# EAGLE design QI-01 (EAGLE 8.7.1)
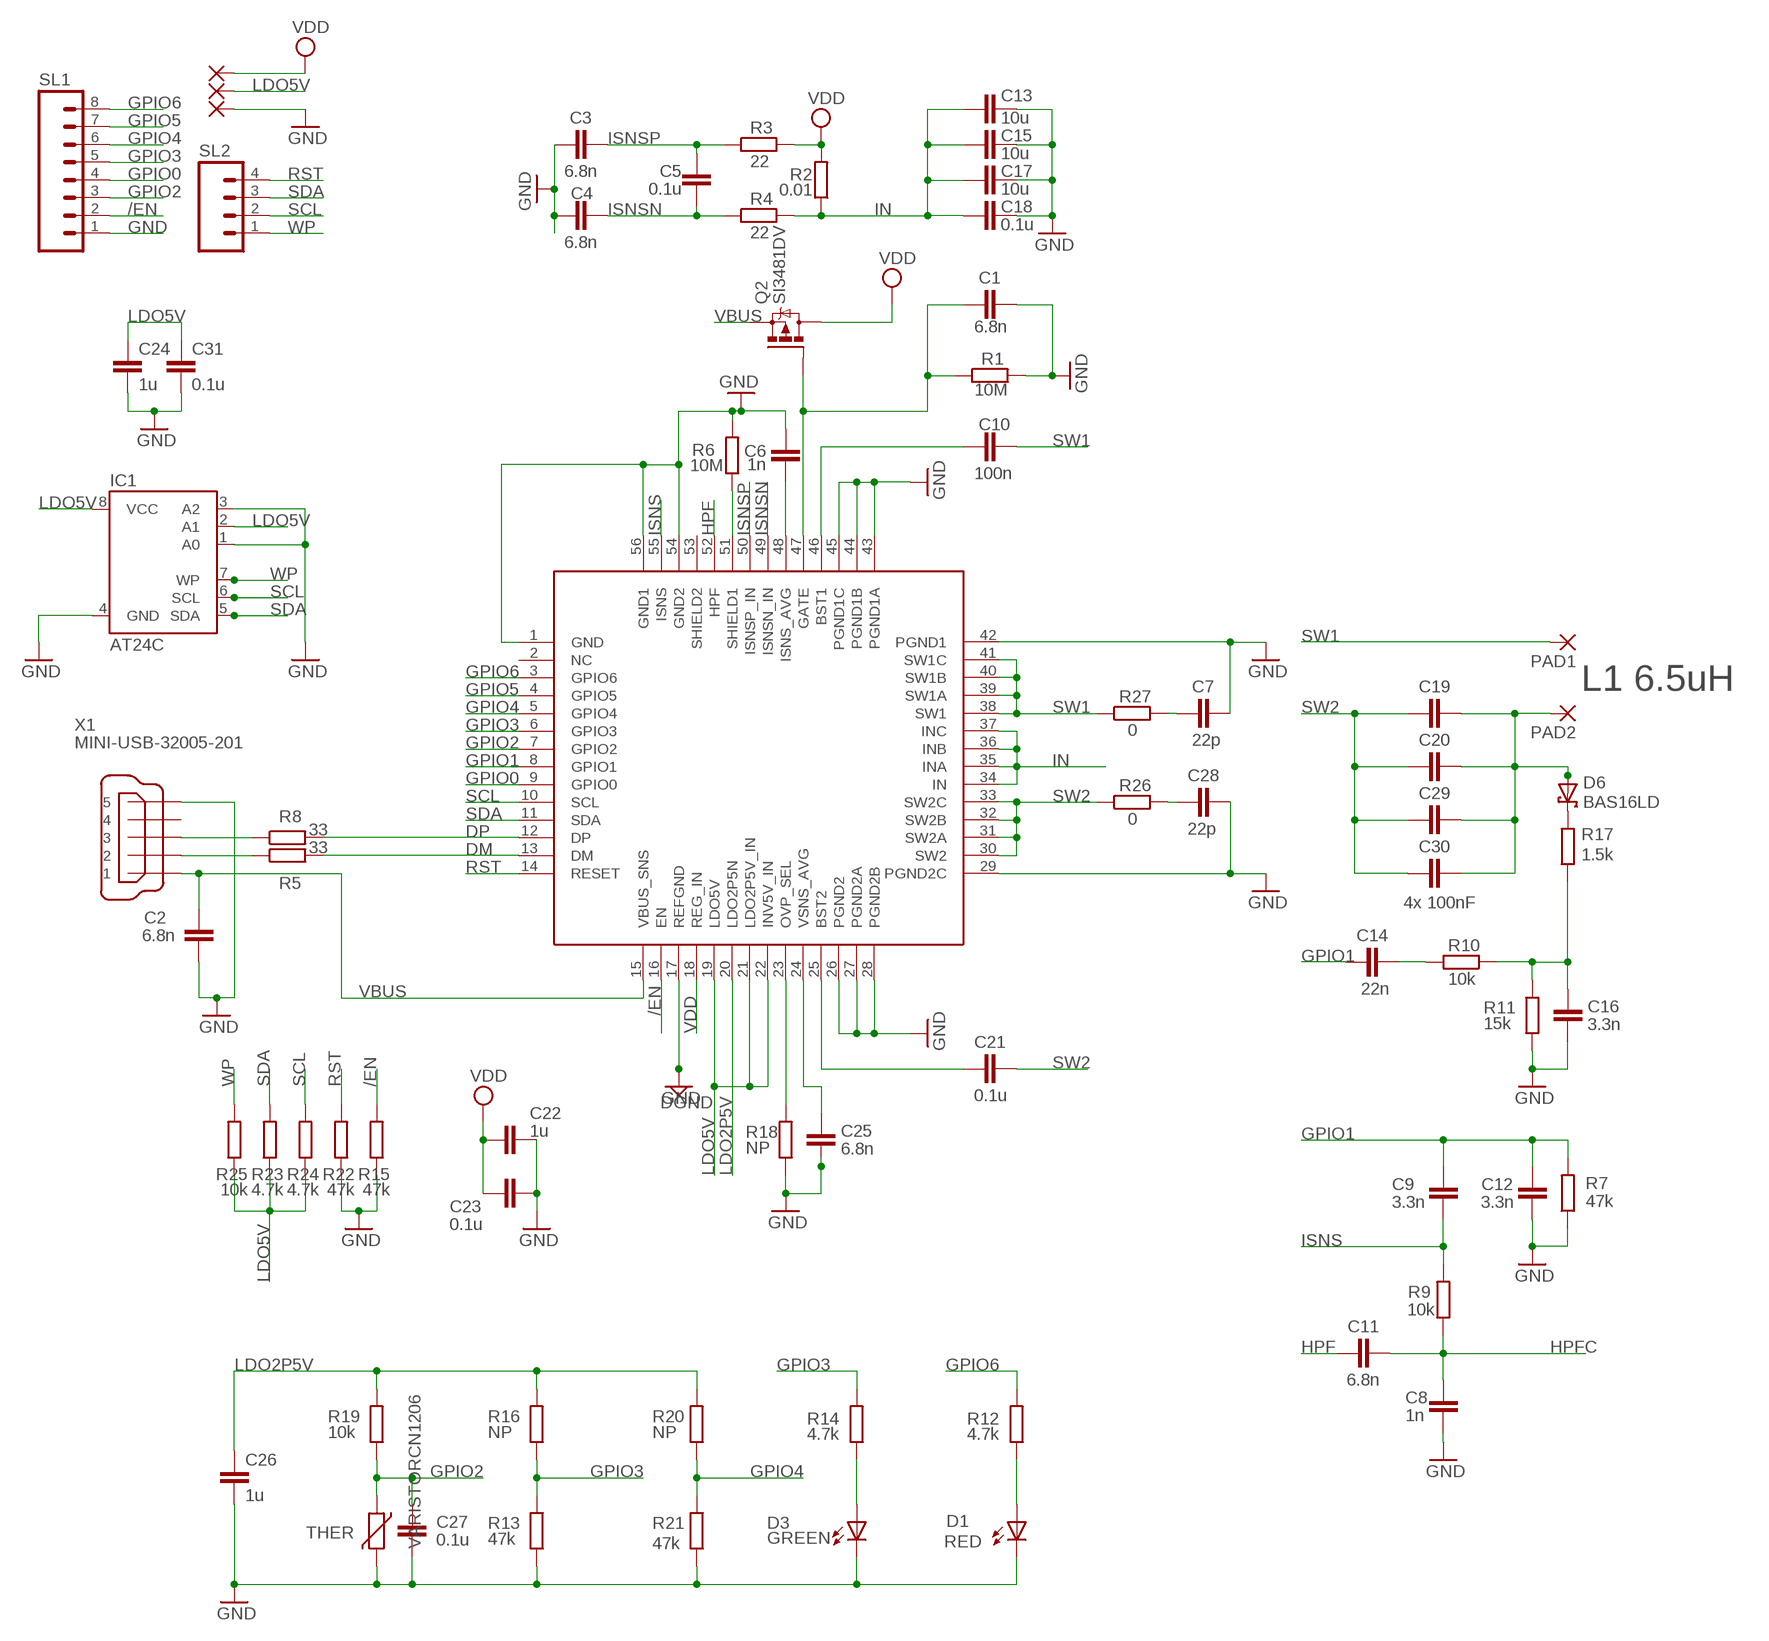
[diagram p0: schematic, sheet 1]

## Parts
C1  6.8n  C-EUC0402  [C0402]
C2  6.8n  C-EUC0402  [C0402]
C3  6.8n  C-EUC0402  [C0402]
C4  6.8n  C-EUC0402  [C0402]
C5  0.1u  C-EUC0402  [C0402]
C6  1n  C-EUC0402  [C0402]
C7  22p  C-EUC0402  [C0402]
C8  1n  C-EUC0402  [C0402]
C9  3.3n  C-EUC0402  [C0402]
C10  100n  C-EUC0402  [C0402]
C11  6.8n  C-EUC0402  [C0402]
C12  3.3n  C-EUC0402  [C0402]
C13  10u  C-EUC0805  [C0805]
C14  22n  C-EUC0402  [C0402]
C15  10u  C-EUC0805  [C0805]
C16  3.3n  C-EUC0402  [C0402]
C17  10u  C-EUC0805  [C0805]
C18  0.1u  C-EUC0402  [C0402]
C19  100n  C-EUC1206  [C1206]
C20  100n  C-EUC1206  [C1206]
C21  0.1u  C-EUC0402  [C0402]
C22  1u  C-EUC0402  [C0402]
C23  0.1u  C-EUC0402  [C0402]
C24  1u  C-EUC0402  [C0402]
C25  6.8n  C-EUC0402  [C0402]
C26  1u  C-EUC0402  [C0402]
C27  0.1u  C-EUC0402  [C0402]
C28  22p  C-EUC0402  [C0402]
C29  100n  C-EUC1206  [C1206]
C30  100n  C-EUC1206  [C1206]
C31  0.1u  C-EUC0402  [C0402]
D1  RED  LEDSML0603  [SML0603]
D3  GREEN  LEDSML0603  [SML0603]
D6  BAS16LD  SCHOTTKY-DIODESMD  [SMB]
IC1  AT24C  [TSSOP8]
PAD1  2,54/1,0  [2,54/1,0]
PAD2  2,54/1,0  [2,54/1,0]
PAD3  2,15/1,0  [2,15/1,0]
PAD4  2,15/1,0  [2,15/1,0]
PAD5  2,15/1,0  [2,15/1,0]
Q2  SI3481DV  [TSOP-6.PAC]
R1  10M  R-EU_R0402  [R0402]
R2  0.01  R-EU_R0805  [R0805]
R3  22  R-EU_R0402  [R0402]
R4  22  R-EU_R0402  [R0402]
R5  33  R-EU_R0402  [R0402]
R6  10M  R-EU_R0402  [R0402]
R7  47k  R-EU_R0402  [R0402]
R8  33  R-EU_R0402  [R0402]
R9  10k  R-EU_R0402  [R0402]
R10  10k  R-EU_R0402  [R0402]
R11  15k  R-EU_R0402  [R0402]
R12  4.7k  R-EU_R0402  [R0402]
R13  47k  R-EU_R0603  [R0603]
R14  4.7k  R-EU_R0402  [R0402]
R15  47k  R-EU_R0603  [R0603]
R16  NP  R-EU_R0402  [R0402]
R17  1.5k  R-EU_R0402  [R0402]
R18  NP  R-EU_R0402  [R0402]
R19  10k  R-EU_R0402  [R0402]
R20  NP  R-EU_R0402  [R0402]
R21  47k  R-EU_R0603  [R0603]
R22  47k  R-EU_R0603  [R0603]
R23  4.7k  R-EU_R0402  [R0402]
R24  4.7k  R-EU_R0402  [R0402]
R25  10k  R-EU_R0402  [R0402]
R26  0  R-EU_R0402  [R0402]
R27  0  R-EU_R0402  [R0402]
SL1  M08  [08P]
SL2  M04  [04P]
THER  VARISTORCN1206  [CT/CN1206]
U$1  VFQFPN  [ZADANIE]
X1  MINI-USB-32005-201  [32005-201]

## Nets
/EN: R15.2 SL1.2 U$1.16(EN)
DM: R5.2 U$1.13(DM)
DP: R8.2 U$1.12(DP)
GND: C1.1 C2.1 C3.1 C4.1 C6.1 C7.1 C8.1 C12.1 C13.1 C15.1 C16.2 C17.1 C18.1 C22.1 C23.1 C24.2 C25.2 C26.2 C27.2 C28.1 C31.2 D1.C D3.C IC1.1(A0) IC1.3(A2) IC1.4(GND) PAD5.1(P) R1.2 R6.2 R7.1 R11.1 R13.1 R15.1 R18.1 R21.1 R22.1 SL1.1 THER.2 U$1.1(GND) U$1.17(REFGND) U$1.26(PGND2) U$1.27(PGND2A) U$1.28(PGND2B) U$1.29(PGND2C) U$1.42(PGND1) U$1.43(PGND1A) U$1.44(PGND1B) U$1.45(PGND1C) U$1.54(GND2) U$1.56(GND1) X1.5 ; supply symbol labelled DGND
GPIO0: SL1.4 U$1.9(GPIO0)
GPIO1: C9.2 C12.2 C14.1 R7.2 U$1.8(GPIO1)
GPIO2: C27.1 R19.1 SL1.3 THER.1 U$1.7(GPIO2)
GPIO3: R13.2 R14.2 R16.1 SL1.5 U$1.6(GPIO3)
GPIO4: R20.1 R21.2 SL1.6 U$1.5(GPIO4)
GPIO5: SL1.7 U$1.4(GPIO5)
GPIO6: R12.2 SL1.8 U$1.3(GPIO6)
HPF: C11.1 U$1.52(HPF)
HPFC: C8.2 C11.2 R9.1
IN: C13.2 C15.2 C17.2 C18.2 R2.1 R4.2 U$1.34(IN) U$1.35(INA) U$1.36(INB) U$1.37(INC)
ISNS: C9.1 R9.2 U$1.55(ISNS)
ISNSN: C4.2 C5.1 R4.1 U$1.49(ISNSN_IN)
ISNSP: C3.2 C5.2 R3.1 U$1.50(ISNSP_IN)
LDO2P5V: C26.1 R16.2 R19.2 R20.2 U$1.20(LDO2P5N)
LDO5V: C24.1 C31.1 IC1.2(A1) IC1.8(VCC) PAD4.1(P) R23.1 R24.1 R25.1 U$1.19(LDO5V) U$1.21(LDO2P5V_IN) U$1.22(INV5V_IN)
N$1: C10.2 U$1.46(BST1)
N$2: R18.2 U$1.23(OVP_SEL)
N$3: C7.2 R27.2
N$5: C16.1 R10.1 R11.2 R17.1
N$6: C21.2 U$1.25(BST2)
N$8: C14.2 R10.2
N$15: C25.1 U$1.24(VSNS_AVG)
N$20: R8.1 X1.3
N$26: R5.1 X1.2
N$29: C19.1 C20.1 C29.1 C30.1 D6.A PAD2.1(P)
N$30: D6.C R17.2
N$31: C28.2 R26.2
N$33: C6.2 U$1.48(ISNS_AVG)
N$35: C1.2 Q2.3(G) R1.1 U$1.47(GATE)
N$37: R6.1 U$1.51(SHIELD1)
N$52: D3.A R14.1
N$54: D1.A R12.1
RST: R22.2 SL2.4 U$1.14(RESET)
SCL: IC1.6(SCL) R24.2 SL2.2 U$1.10(SCL)
SDA: IC1.5(SDA) R23.2 SL2.3 U$1.11(SDA)
SW1: C10.1 PAD1.1(P) R27.1 U$1.38(SW1) U$1.39(SW1A) U$1.40(SW1B) U$1.41(SW1C)
SW2: C19.2 C20.2 C21.1 C29.2 C30.2 R26.1 U$1.30(SW2) U$1.31(SW2A) U$1.32(SW2B) U$1.33(SW2C)
VBUS: C2.2 Q2.4(S) U$1.15(VBUS_SNS) X1.1
VDD: C22.2 C23.2 PAD3.1(P) Q2.1(D) Q2.2(D) Q2.5(D) Q2.6(D) R2.2 R3.2 U$1.18(REG_IN)
WP: IC1.7(WP) R25.2 SL2.1
Unconnected: U$1.2(NC) U$1.53(SHIELD2) X1.4

## Notes on the sheet
- L1 6.5uH
- 4x 100nF

## Library data of the parts
C1-C31 = rcl:C-EU: CAPACITOR, European symbol; SPICEPREFIX: C
D1 D3 = led:LED: LED OSRAM: - CHIPLED LG R971, LG N971, LY N971, LG Q971, LY Q971, LO R971, LY R971 LH N974, LH R974 LS Q976, LO Q976, LY Q976 LO Q996 - Hyper CHIPLED LW Q18S LB Q993, LB Q99A, LB R99A - SideLED LS A670, LO A670, LY A670, LG A670, LP A670 LB A673, LV A673, LT A673, LW A673 LH A674 LY A675 LS A676, LA A676, LO A676, LY A676, LW A676 LS A679, LY A679, LG A679 - Hyper Micro SIDELED® LS Y876, LA Y876, LO Y876, LY Y876 LT Y87S - SmartLED LW L88C, LW L88S LB L89C, LB L89S, LG L890 LS L89K, LO L89K, LY L89K LS L896, LA L896, LO L896, LY L896 - TOPLED LS T670, LO T670, LY T670, LG T670, LP T670 LSG T670, LSP T670, LSY T670, LOP T670, LYG T670 LG T671, LOG T671, LSG T671 LB T673, LV T673, LT T673, LW T673 LH T674 LS T676, LA T676, LO T676, LY T676, LB T676, LH T676, LSB T676, LW T676 LB T67C, LV T67C, LT T67C, LS T67K, LO T67K, LY T67K, LW E67C LS E67B, LA E67B, LO E67B, LY E67B, LB E67C, LV E67C, LT E67C LW T67C LS T679, LY T679, LG T679 LS T770, LO T770, LY T770, LG T770, LP T770 LB T773, LV T773, LT T773, LW T773 LH T774 LS E675, LA E675, LY E675, LS T675 LS T776, LA T776, LO T776, LY T776, LB T776 LHGB T686 LT T68C, LB T68C - Hyper Mini TOPLED® LB M676 - Mini TOPLED Santana® LG M470 LS M47K, LO M47K, LY M47K Source: http://www.osram.convergy.de LUXEON: - LUMILED® LXK2-PW12-R00, LXK2-PW12-S00, LXK2-PW14-U00, LXK2-PW14-V00 LXK2-PM12-R00, LXK2-PM12-S00, LXK2-PM14-U00 LXK2-PE12-Q00, LXK2-PE12-R00, LXK2-PE12-S00, LXK2-PE14-T00, LXK2-PE14-U00 LXK2-PB12-K00, LXK2-PB12-L00, LXK2-PB12-M00, LXK2-PB14-N00, LXK2-PB14-P00, LXK2-PB14-Q00 LXK2-PR12-L00, LXK2-PR12-M00, LXK2-PR14-Q00, LXK2-PR14-R00 LXK2-PD12-Q00, LXK2-PD12-R00, LXK2-PD12-S00 LXK2-PH12-R00, LXK2-PH12-S00 LXK2-PL12-P00, LXK2-PL12-Q00, LXK2-PL12-R00 Source: www.luxeon.com KINGBRIGHT: KA-3528ASYC Source: www.kingbright.com
D6 = diode:SCHOTTKY-DIODE: Schottky Diode
IC1 = atmel:AT24C*: 2-wire serial EEPROM; SPICEPREFIX: X
PAD1 PAD2 = wirepad:2,54/1,0: THROUGH-HOLE PAD
PAD3-PAD5 = wirepad:2,15/1,0: THROUGH-HOLE PAD
Q2 = transistor-power:SI3481DV: P-Channel 30-V (D-S) MOSFET Source: http://www.vishay.com/docs/72105/72105.pdf
R1-R27 = rcl:R-EU_: RESISTOR, European symbol; SPICEPREFIX: R
SL1 = con-amp-quick:M08: AMP QUICK CONNECTOR; OC_FARNELL: unknown; OC_NEWARK: unknown
SL2 = con-amp-quick:M04: AMP QUICK CONNECTOR; OC_FARNELL: unknown; OC_NEWARK: unknown
THER = varistor:VARISTOR: VARISTOR
U$1 = zadanie2 - 01:VFQFPN
X1 = con-cypressindustries:MINI-USB-: MINI USB-B Conector Source: www.cypressindustries.com; OC_FARNELL: unknown; OC_NEWARK: unknown

## Board
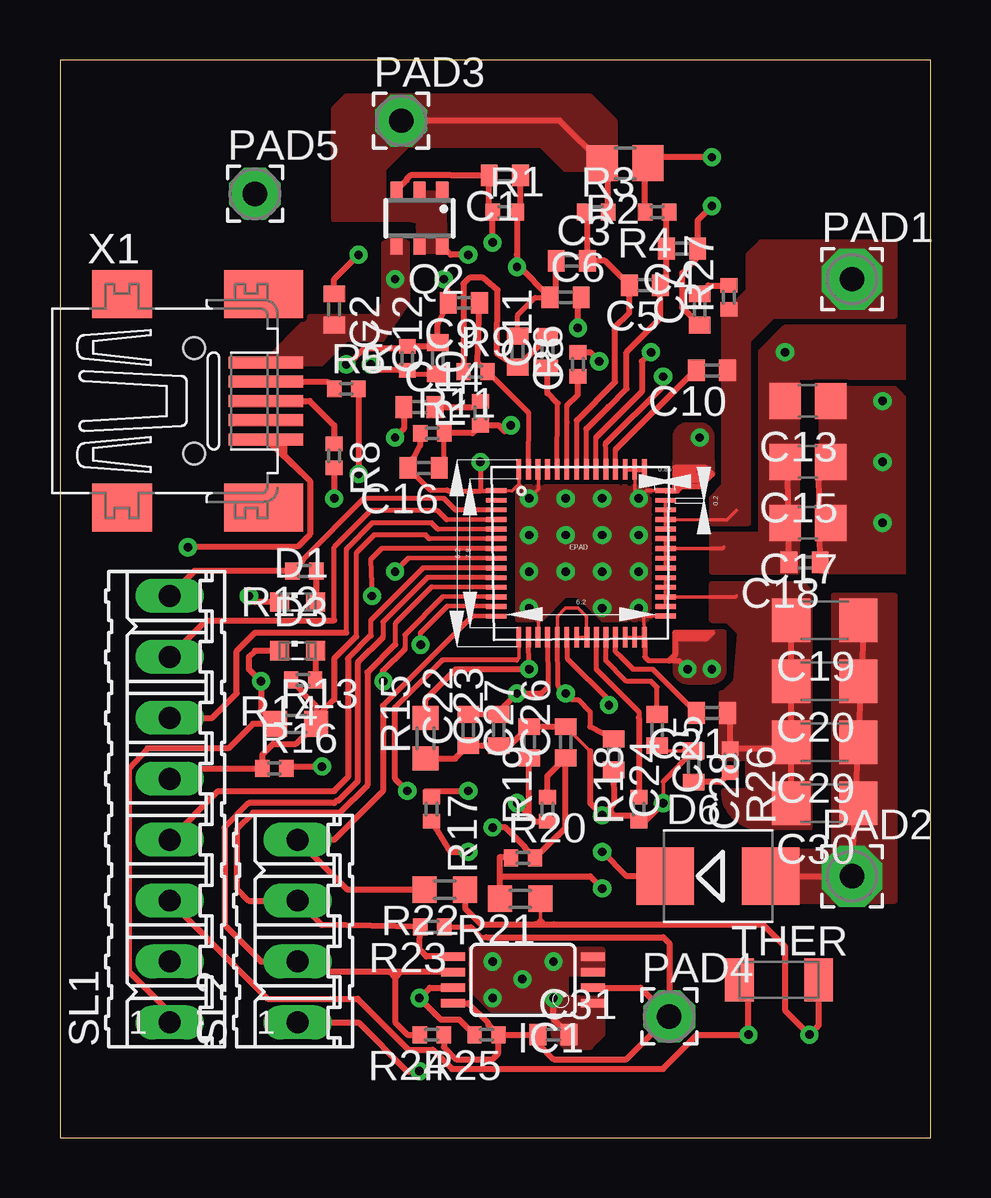
[diagram p1: board, top side]
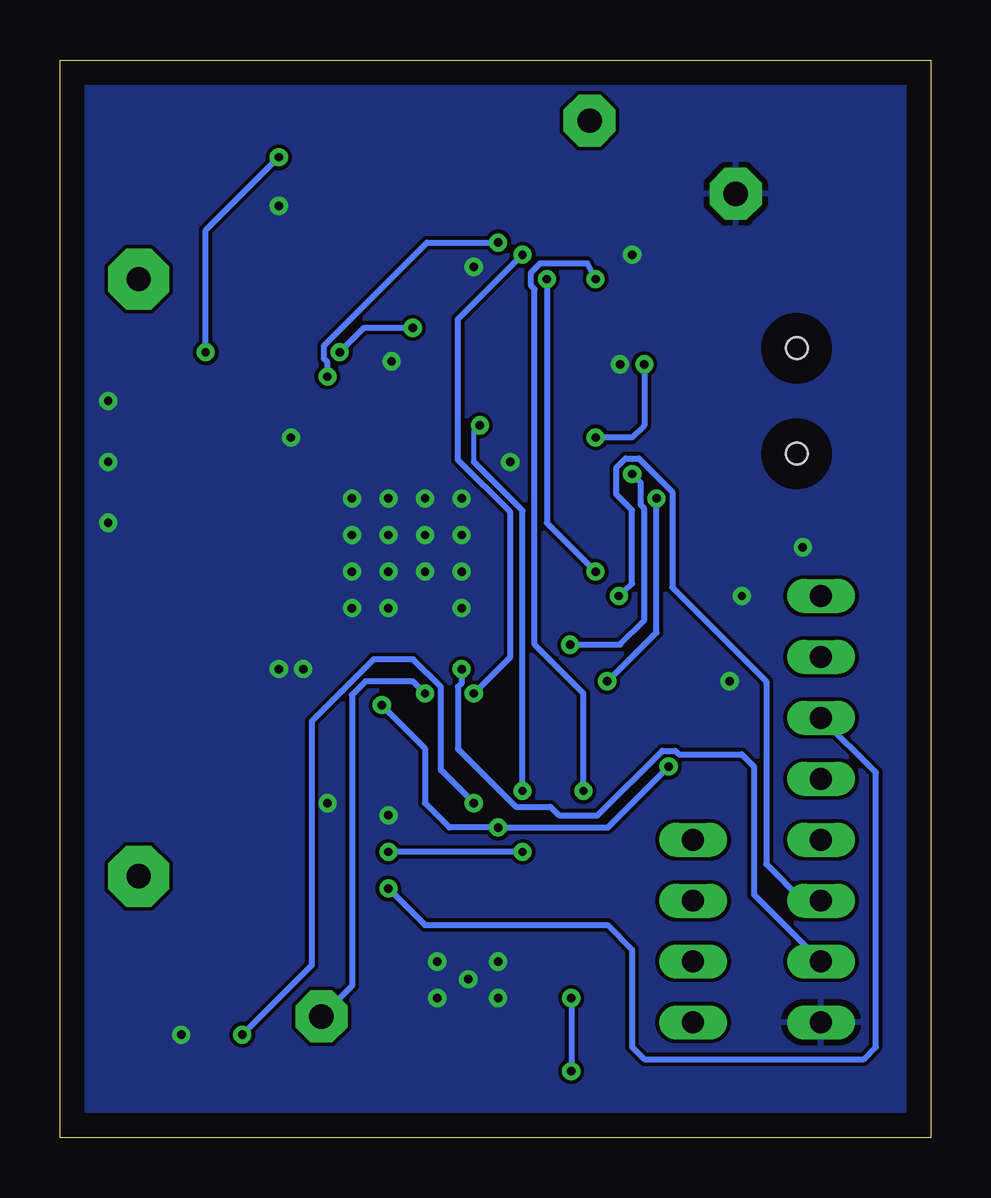
[diagram p2: board, bottom side, seen from below]

Size 36.3 x 44.93 mm. Coordinates in mm from the lower left corner, seen from the top.
Outline: 0,0 36.3,0 36.3,44.93 0,44.93 0,0
Copper layers (1*16): Top 0.035mm / dielectric 1.5mm / Bottom 0.035mm
Design rules "default": minimum track width 6mil, minimum drill 0.35mm, track to track 6mil, track to pad 6mil, pad to pad 6mil, via to via 6mil, smd to smd 6mil, copper to edge 40mil, drill to drill 6mil, minimum pad ring 10mil, minimum via ring 8mil, stop-mask expansion 4mil, vias tented up to drill 0mil, thermal gap 10mil

### Footprints (pad centres in the part's own frame; a part is rotated, then mirrored left to right if it is on the bottom)
C0402 = smd 0.7 x 0.9: 1 -0.65,0; 2 0.65,0
C0805 = smd 1.3 x 1.5: 1 -0.95,0; 2 0.95,0
C1206 = smd 1.6 x 1.8: 1 -1.4,0; 2 1.4,0
SML0603 = smd 0.8 x 0.8: A 0.75,0; C -0.75,0
SMB = smd 2.4 x 2.4: A 2.2,0; C -2.2,0
TSSOP8 = smd 0.35 x 1: 1 -0.975,-2.925; 2 -0.325,-2.925; 3 0.325,-2.925; 4 0.975,-2.925; 5 0.975,2.925; 6 0.325,2.925; 7 -0.325,2.925; 8 -0.975,2.925
2,54/1,0 = drill 1.016 pad 2.54 octagon: 1 0,0
2,15/1,0 = drill 1.016 pad 2.159 octagon: 1 0,0
TSOP-6.PAC = smd 0.508 x 0.7: 1 -0.95,-1.163; 2 0,-1.163; 3 0.95,-1.163; 4 0.95,1.163; 5 0,1.163; 6 -0.95,1.163
R0402 = smd 0.6 x 0.7: 1 -0.5,0; 2 0.5,0
R0805 = smd 1.3 x 1.5: 1 -0.95,0; 2 0.95,0
R0603 = smd 1 x 1.1: 1 -0.85,0; 2 0.85,0
08P = drill 0.914 long: 1 -8.89,0; 2 -6.35,0; 3 -3.81,0; 4 -1.27,0; 5 1.27,0; 6 3.81,0; 7 6.35,0; 8 8.89,0
04P = drill 0.914 long: 1 -3.81,0; 2 -1.27,0; 3 1.27,0; 4 3.81,0
CT/CN1206 = smd 1.2 x 1.8: 1 -1.65,0; 2 1.65,0
ZADANIE = smd 0.85 x 0.2: 1 -41.75,9.215; 2 -41.75,8.815; 3 -41.75,8.415; 4 -41.75,8.015; 5 -41.75,7.615; 6 -41.75,7.215; 7 -41.75,6.805; 8 -41.75,6.395; 9 -41.75,5.985; 10 -41.75,5.585; 11 -41.75,5.185; 12 -41.75,4.785; 13 -41.75,4.385; 14 -41.75,3.98; 29 -34.7,3.985; 30 -34.7,4.385; 31 -34.7,4.78; 32 -34.7,5.185; 33 -34.7,5.585; 34 -34.7,5.985; 35 -34.7,6.395; 36 -34.7,6.805; 37 -34.7,7.215; 38 -34.7,7.615; 39 -34.7,8.015; 40 -34.7,8.415; 41 -34.7,8.81; 42 -34.7,9.215 | smd 0.2 x 0.85: 15 -40.815,3.1; 16 -40.415,3.1; 17 -40.015,3.1; 18 -39.615,3.1; 19 -39.215,3.1; 20 -38.815,3.1; 21 -38.405,3.1; 22 -37.98,3.1; 23 -37.585,3.1; 24 -37.185,3.1; 25 -36.785,3.1; 26 -36.385,3.1; 27 -35.985,3.1; 28 -35.585,3.1; 43 -35.585,10.1; 44 -35.985,10.1; 45 -36.385,10.1; 46 -36.785,10.1; 47 -37.185,10.1; 48 -37.595,10.1; 49 -38,10.1; 50 -38.4,10.1; 51 -38.815,10.1; 52 -39.215,10.1; 53 -39.615,10.1; 54 -40.015,10.1; 55 -40.415,10.1; 56 -40.815,10.1
32005-201 = smd 3.1 x 0.5: 1 3,1.6; 2 3,0.8; 3 3,0; 4 3,-0.8; 5 3,-1.6 | smd 2.5 x 2: M1 -3,-4.45; M2 -3,4.45 | smd 3.3 x 2: M3 2.9,4.45; M4 2.9,-4.45 | hole 0.9: 0,2.2; 0,-2.2

### Placement (x,y rotation side)
C1  18.54,40.12 180 top
C2  11.43,34.53 270 top
C3  21.34,36.56 0 top
C4  25.93,37.07 180 top
C5  24.38,35.54 180 top
C6  21.08,35.04 0 top
C7  26.67,34.53 90 top
C8  19.08,32.78 270 top
C9  16.84,34.81 180 top
C10  27.18,31.99 180 top
C11  20.32,32.75 90 top
C12  15.75,32.5 90 top
C13  31.18,30.72 180 top
C14  14.99,30.46 0 top
C15  31.18,28.18 180 top
C16  15.16,27.92 180 top
C17  31.18,25.64 180 top
C18  31.04,23.99 180 top
C19  31.88,21.57 180 top
C20  31.88,19.03 180 top
C21  27.18,17.71 180 top
C22  17.02,17 90 top
C23  18.29,17 90 top
C24  23.09,15.99 270 top
C25  24.89,17 270 top
C26  21.08,16.49 90 top
C27  19.56,16.49 90 top
C28  26.42,15.48 270 top
C29  31.88,16.49 180 top
C30  31.88,13.95 180 top
C31  20.57,4.3 0 top
D1  9.91,22.34 0 top
D3  9.91,20.3 0 top
D6  27.43,10.91 0 top
IC1  19.3,6.59 90 top
PAD1  33.02,35.8 0 top
PAD2  33.02,10.91 0 top
PAD3  14.22,42.4 0 top
PAD4  25.4,5.06 0 top
PAD5  8.13,39.35 0 top
Q2  14.99,38.34 180 top
R1  18.54,38.59 0 top
R2  23.56,40.62 180 top
R3  22.35,38.59 0 top
R4  24.89,38.59 180 top
R5  11.94,31.23 0 top
R6  21.59,32.24 90 top
R7  14.48,32.5 90 top
R8  11.43,28.43 270 top
R9  17.32,31.94 0 top
R10  17.53,30.21 90 top
R11  15.52,29.37 0 top
R12  10.19,23.63 180 top
R13  9.82,17.26 0 top
R14  10.13,19.08 180 top
R15  15.24,16.66 90 top
R16  8.94,15.4 0 top
R17  15.49,13.7 270 top
R18  24.13,13.7 90 top
R19  20.32,13.7 90 top
R20  19.3,11.67 0 top
R21  19.19,9.97 180 top
R22  16.04,10.35 180 top
R23  15.52,8.8 180 top
R24  15.49,4.3 180 top
R25  17.78,4.3 180 top
R26  27.94,15.73 270 top
R27  27.89,35.04 90 top
SL1  4.57,13.7 90 top
SL2  9.91,8.62 90 top
THER  29.97,6.59 0 top
U$1  59.94,17.76 0 top
X1  5.59,30.72 0 top

### Tracks (layer width: path | path; a pad name or v marks a point on that pad's centre or on a via)
/EN  (via drill 0.35)
  Top 0.152: v19.56,19.54 19.54,19.56
  Top 0.2: 19.54,19.56 U$1.16
  Top 0.254: R15.2 15.24,18.27 16.51,19.54 v19.56,19.54
  Bottom 0.254: v19.56,19.54 19.56,18.95 19.71,18.8 19.71,16.22 17.29,13.8 15.85,13.8 15.49,13.45 13.88,13.45 11.19,16.14 10.65,16.14 10.5,15.99 7.87,15.99 7.37,15.48 7.37,10.14 SL1.2
DM  (via drill 0.35)
  Top 0.2: 15.02,20.59 15.02,21.03 16.15,22.16 U$1.13
  Top 0.254: 15.02,20.59 v15.04,20.56 | R5.2 v12.44,27.68 v12.45,27.67
  Bottom 0.254: v15.04,20.56 12.95,20.56 11.94,21.57 11.94,26.23 12.09,26.38 12.09,27.31 v12.45,27.67
DP  (via drill 0.35)
  Top 0.2: 14.38,20.39 14.38,20.96 15.98,22.56 U$1.12
  Top 0.254: v13.49,19.03 13.46,19.47 14.38,20.39 | R8.2 v11.43,26.65
  Bottom 0.254: v13.49,19.03 11.43,21.07 v11.43,26.65
GND  (via drill 0.35)
  Top 0.152: U$1.17 19.94,21.7 v19.56,22.08 | U$1.29 24.45,21.76 v24.13,22.08 24.34,21.87 U$1.28 U$1.27 U$1.26 | 19.14,27.26 U$1.56 | U$1.1 18.85,26.96 19.14,27.26 | 19.14,27.26 19.56,26.84 v19.56,26.65 19.94,27.04 U$1.54 | 22.1,16.13 C26.2 | C25.2 25.12,16.13 C28.1 | U$1.44 23.96,26.82 v24.13,26.65 24.45,26.98 U$1.42 | 25.15,14.86 v25.15,13.95 | R21.1 20.04,9.13 | 20.04,9.13 20.04,8.93 20.07,8.91 | 20.04,9.13 20.26,8.91 20.57,8.91 | 20.04,9.13 19.82,8.91 19.81,8.91
  Top 0.2: U$1.45 U$1.44 U$1.43 | U$1.28 24.38,20.82 24.38,20.05 24.54,19.89 25.4,19.89 25.81,19.89 v26.16,19.54 | C28.1 25.15,14.86 | C8.1 19.08,34.3 19.81,35.04 C6.1 | R7.1 14.63,31.85 C12.1 | 8.38,17.84 R13.1 | C16.2 15.43,27.01 16.15,27.01 16.19,26.96 17.53,26.96 | 17.53,26.96 U$1.1 | v17.53,28.18 17.53,26.96
  Top 0.203: 22.99,13.57 22.86,13.7 | 23.11,13.45 22.99,13.57 | 22.99,13.57 22.99,13.83
  Top 0.254: C18.1 31.64,27.69 C15.1 | v25.15,13.95 24.39,13.2 R18.1 23.88,13.45 23.11,13.45 v22.61,13.45 | 10.25,27.55 10.42,27.38 10.42,25.15 10.25,24.99 9.92,24.66 9.4,24.62 v5.33,24.62 | 10.25,27.55 9.22,28.52 | C2.1 11.43,35.8 v12.45,36.81 | C1.1 19.19,38.74 R1.2 19.04,36.82 19.05,36.81 19.05,36.42 19.11,36.36 | C3.1 20.69,35.29 C6.1 19.11,36.36 | R15.1 16.48,15.81 C22.1 C23.1 18.77,16.35 C27.2 C26.2 | R22.1 16.89,9.58 17.56,8.91 19.81,8.91 20.07,8.91 20.57,8.91 29.3,8.91 30.23,7.98 30.23,5.32 v31.24,4.3 31.62,4.68 THER.2 | C31.2 20.57,4.95 v20.57,5.83 | R6.2 21.6,32.75 22.1,32.75 v22.48,32.37 | v19.05,36.31 19.11,36.36 | v22.61,13.45 22.86,13.7 22.99,13.83 23.11,13.95 C24.2 | v22.61,13.45 22.1,13.95 22.1,16.13 | SL1.1 4.57,5.24 2.87,6.94 2.87,15.38 3.65,16.24 7.03,16.24 8.04,17.26 R13.1 | D1.C 8.13,22.34 v7.87,22.59 | D3.C 8.13,20.3 7.87,20.05 7.87,19.54 v8.38,19.03 8.38,17.84 | R7.1 13.2,32 v12.95,32.24 | R11.1 15.02,28.87 C16.2 | C7.1 25.94,34.61 25.94,36.05 26.5,36.61 26.5,36.98 C4.1 26.58,38.25 v27.18,38.85 | U$1.42 25.73,26.98 25.91,27.16 26.67,27.16 27.18,27.67 26.92,27.92 26.67,27.92 | 26.67,27.92 26.42,27.92 | 26.42,27.92 25.65,27.92 25.65,27.67 | 25.65,27.67 25.65,27.16 25.91,27.42 | 26.16,27.42 25.91,27.42 | 26.67,27.42 26.16,27.42 | 26.67,27.42 26.92,27.67 26.67,27.92 | 26.67,27.42 26.67,27.92 | 26.42,27.67 26.67,27.42 | 26.42,27.67 26.42,27.92 | 26.16,27.42 26.42,27.67 | 25.91,27.67 26.16,27.42 | 25.91,27.67 25.65,27.67 | 25.91,27.42 25.91,27.67 | 25.91,27.42 26.16,27.67 | 26.42,27.92 26.16,27.67 | 26.16,27.67 25.91,27.67 | 25.4,19.89 25.65,20.15 25.65,20.81 | 25.65,20.81 25.65,21.07 27.18,21.07 26.92,20.81 25.65,20.81
  Top 0.254: 8.98,28.77 8.63,29.12 X1.5 8.81,28.9 9.36,28.9 | 8.98,28.77 9.36,28.39 9.36,28.9 | 9.4,28.94 9.36,28.9 | 10.25,27.55 9.03,28.77 8.98,28.77
  other vias: 21.08,26.65 22.61,26.65 24.13,25.13 22.61,25.13 21.08,25.13 19.56,25.13 19.56,23.61 21.08,23.61 22.61,23.61 24.13,23.61 22.61,22.08 26.67,29.19 27.18,19.54 18.03,7.35 20.57,7.35 19.28,6.61 18.03,5.83 34.29,25.64 34.29,28.18 34.29,30.72
  pour Top (no thermals): 25.65,20.56 25.65,19.54 arc90 26.16,19.03 26.67,19.03 27.18,19.03 arc90 27.69,19.54 27.69,20.56 27.69,21.07 27.18,21.07 arc-90 26.67,20.56
  pour Top (no thermals): 31.75,23.61 31.75,31.23 34.8,31.23 35.31,30.72 35.31,23.61
  pour Top (no thermals): 25.65,28.18 26.67,28.18 arc90 27.18,27.67 27.18,29.19 arc90 26.67,29.7 26.16,29.7 arc90 25.65,29.19
  pour Top (no thermals): 25.65,27.16 25.65,28.18 27.18,28.18 27.18,27.67 26.67,27.16
  pour Top (no thermals): 25.65,20.56 25.65,21.07 27.58,21.02 27.69,20.56
  pour Bottom: 0.25,44.43 35.81,44.43 35.81,0.25 0.25,0.25
  pour Top (no thermals): 17.02,7.86 21.08,7.86 22.61,7.86 22.61,6.84 21.59,6.84 21.08,6.84 21.08,5.83 22.61,5.83 22.61,5.32 18.54,5.32 18.03,5.32 17.53,5.83 17.02,6.33
  pour Top (no thermals): 21.08,3.79 22.1,3.79 22.61,4.3 22.61,5.83 20.57,5.83 20.57,4.81 20.57,4.3
  pour Top: 19.05,27.16 19.05,21.57 20.07,21.57 21.08,22.59 21.59,22.59 22.61,21.57 24.64,21.57 24.64,27.16
GPIO0
  Top 0.2: 12.95,20.93 12.95,21.57 15.14,23.76 U$1.9
  Top 0.254: 12.95,20.93 12.01,19.98 12.01,15.04 11.43,14.46 6.6,14.46 SL1.4
GPIO1  (via drill 0.35)
  Top 0.2: v13.97,23.61 14.43,24.06 14.53,24.16 U$1.8
  Top 0.254: v16,35.8 16.11,35.69 C9.2 15.75,33.91 C12.2 15.6,33 R7.2 14.38,32.9 12.68,32.9 12.02,32.24 v11.94,32.24 | C14.1 14.34,29.56 v13.97,29.19
  Bottom 0.254: v16,35.8 16,25.64 v13.97,23.61 | v11.94,32.24 11.94,29.7 12.45,29.19 v13.97,29.19
GPIO2  (via drill 0.35)
  Top 0.2: U$1.7 13.4,24.56 12.95,24.11 v13.01,22.59
  Top 0.254: R19.1 19.8,13.2 19.56,13.45 | 19.56,13.45 C27.1 | 19.56,13.45 v19.05,13.95 | THER.1 28.7,6.21 v28.7,4.3 26.56,4.3 25.14,2.88 16.34,2.88 15.55,3.67 14.54,3.67 12.41,5.8 8.66,5.8 SL1.3
  Bottom 0.254: v13.01,22.59 12.45,23.1 12.45,26.17 13.1,26.82 13.1,27.94 12.72,28.33 12.17,28.33 10.77,26.93 10.77,22.95 6.86,19.03 6.86,11.41 5.33,9.89 SL1.3 | v19.05,13.95 20.42,15.33 20.42,18.8 21.57,19.95 23.23,19.95 25.8,17.37 25.8,7.2 v28.7,4.3
GPIO3
  Top 0.2: 12.34,20.9 12.34,24.39 13.09,25.13 15.24,25.13 15.41,24.96 U$1.6
  Top 0.254: R14.2 10.05,18.66 10.05,18.62 10.67,18.01 10.67,17.51 | 10.67,17.51 R13.2 9.84,16.43 8.89,16.43 8.44,15.98 R16.1 5,15.4 SL1.5 | 12.34,20.9 11.43,19.98 11.43,18.27 10.67,17.51
GPIO4  (via drill 0.35)
  Top 0.2: 11.94,21.07 11.94,24.55 13.02,25.64 15.49,25.64 15.77,25.36 U$1.5
  Top 0.254: SL1.6 6.35,17.51 7.37,18.53 7.37,20.3 8.13,21.07 11.94,21.07 | R21.2 18.34,10.91 | 18.34,10.91 18.34,11.71 18.52,11.69 18.78,11.69 R20.1 | 18.34,10.91 22.1,10.91 v22.61,10.4
  Bottom 0.254: v22.61,10.4 21.08,8.87 13.46,8.87 12.45,7.86 12.45,3.79 11.94,3.29 2.79,3.29 2.29,3.79 2.29,15.22 SL1.6
GPIO5
  Top 0.2: 11.43,21.57 11.43,24.62 12.95,26.15 15.75,26.15 16.13,25.76 U$1.4
  Top 0.254: SL1.7 6.1,21.57 11.43,21.57
GPIO6
  Top 0.2: 10.11,24.1 12.66,26.65 16,26.65 16.49,26.16 U$1.3
  Top 0.254: 10.11,24.1 10.11,24.05 R12.2 5.61,23.63 SL1.8
HPF
  Top 0.2: 20.32,31.73 C11.1 | U$1.52 20.74,30.61
  Top 0.254: 20.74,30.61 20.32,31.04 20.32,31.73
HPFC
  Top 0.254: C11.2 20.32,33.37 C8.2 18.22,32.67 18.25,35.35 17.64,35.85 17.07,35.85 16.82,35.6 R9.1
IN  (via drill 0.35)
  Top 0.152: U$1.34 U$1.35 U$1.36 | U$1.36 U$1.37 | U$1.36 27.63,24.56 27.69,24.62
  Top 0.254: C18.2 30.34,28.07 C15.2 | R4.2 24.39,40.51 R2.1 24.76,40.88 v27.18,40.88
  Bottom 0.254: v30.23,32.75 30.23,37.83 v27.18,40.88
  pour Top (no thermals): 27.18,23.61 30.73,23.61 30.73,31.73 35.31,31.73 35.31,33.77 30.23,33.77 29.21,32.75 29.21,25.13 27.18,25.13
ISNS
  Top 0.2: U$1.55 19.54,30.22 R9.2
  Top 0.254: R9.2 17.41,32.35 C9.1
ISNSN
  Top 0.2: U$1.49 21.94,29.55
  Top 0.254: R4.1 25.29,38.49 C4.2 25.29,35.8 C5.1 25.03,34.16 23.62,32.75 23.62,31.23 22.86,30.46 22.61,30.21 21.94,29.55
ISNSP
  Top 0.2: U$1.50 21.54,29.91
  Top 0.254: R3.1 21.99,38.46 C3.2 22.72,36.56 C5.2 23.73,34.39 23.14,33.8 23.14,31.51 21.54,29.91
LDO2P5V  (via drill 0.35)
  Top 0.152: 22.88,18.25 v22.88,18.04
  Top 0.2: U$1.20 21.14,19.99 22.88,18.25
  Top 0.254: R19.2 20.32,15.08 C26.1 21.08,12.92 20.79,12.62 20.76,12.62 R20.2 19.38,12.09 19.38,12.13 18.58,12.94 v18.03,12.94 | R16.2 9.52,15.48 v10.92,15.48
  Bottom 0.254: v10.92,15.48 13.46,12.94 v18.03,12.94 20.07,12.94 21.08,13.95 21.08,16.24 v22.88,18.04
LDO5V  (via drill 0.35)
  Top 0.152: U$1.19 20.74,21.74 21.08,22.08 21.59,22.08 21.94,21.73 U$1.22 U$1.21
  Top 0.2: U$1.19 20.74,18.86 v21.08,18.53 21.34,18.27 21.59,18.27 22.1,17.76 22.1,17.14
  Top 0.203: R23.1 17.13,8.8 17.56,8.37 17.78,8.37
  Top 0.254: R24.1 16,3.79 16.51,3.29 18.03,3.29 18.28,3.53 R25.1 | R25.1 C31.1 19.92,3.94 20.57,3.29 23.62,3.29 PAD4.1 | R25.1 17.86,4.72 17.86,4.77 17.01,5.61 IC1.8 | IC1.2 24.2,6.26 PAD4.1 | 17.78,8.37 25.15,8.37 25.4,8.11 PAD4.1 | 22.1,17.14 C24.1
  Bottom 0.254: PAD4.1 24.13,6.33 24.13,18.46 23.56,19.03 21.59,19.03 v21.08,18.53
N$1
  Top 0.203: U$1.46 23.16,28.69
  Top 0.254: 23.16,28.69 26.46,31.99 C10.2
N$2
  Top 0.2: U$1.23 22.35,19.54 24.13,17.76 24.13,17.51
  Top 0.254: 24.13,17.51 R18.2
N$3
  Top 0.254: C7.2 27.03,35.54 R27.2
N$5  (via drill 0.35)
  Top 0.2: C16.1 16.02,28.13 R11.2
  Top 0.254: R11.2 17.19,29.37 R10.1 18.28,29.71 18.54,29.45 v18.8,29.7 | R17.1 15.25,14.46 v17.02,14.46
  Bottom 0.2: 19.05,28.18 19.05,29.45 v18.8,29.7
  Bottom 0.254: v17.02,14.46 17.02,26.15 19.05,28.18
N$6
  Top 0.2: 23.4,20.02 23.88,19.54 24.7,19.54 C21.2
  Top 0.203: 23.4,20.02 23.16,20.26 U$1.25
N$8
  Top 0.254: C14.2 17.28,30.46 R10.2
N$15
  Top 0.2: U$1.24 22.74,19.91 23.62,19.03 24.64,19.03 24.89,18.78 C25.1
N$20
  Top 0.254: X1.3 10.41,30.72 11.43,29.7 R8.1
N$26
  Top 0.254: X1.2 11.15,31.52 R5.1
N$29
  Top 0.254: C19.1 33.53,21.33 PAD2.1 D6.A
  pour Top (no thermals): 28.7,9.89 34.8,9.89 34.8,22.59 32.26,22.59 32.26,12.43 32.26,11.92 28.7,11.92
N$30  (via drill 0.35)
  Top 0.254: R17.2 16.26,11.92 v17.02,11.92 | D6.C 23.62,10.91 v22.61,11.92
  Bottom 0.254: v17.02,11.92 v22.61,11.92
N$31
  Top 0.254: C28.2 27.54,14.83 R26.2
N$33  (via drill 0.35)
  Top 0.2: U$1.48 22.34,29.19
  Top 0.254: v21.59,33.77 21.59,34.89 C6.2 | 22.34,29.19 24.26,31.11 24.26,32.37 v24.64,32.75
  Bottom 0.254: v24.64,32.75 23.62,33.77 v21.59,33.77
N$35  (via drill 0.35)
  Top 0.2: U$1.47 22.75,28.68 22.75,28.94
  Top 0.254: Q2.3 14.45,39.92 14.45,39.97 14.62,40.13 16.31,40.13 16.32,40.12 C1.2 17.89,38.74 R1.1 18.03,38.58 v18.03,37.32 | 22.75,28.94 25.15,31.34 v25.15,31.73
  Bottom 0.254: v25.15,31.73 25.15,32.33 25.3,32.48 25.3,33.02 21,37.32 v18.03,37.32
N$37
  Top 0.2: U$1.51 21.14,29.83 21.14,30.53
  Top 0.254: 21.14,30.53 21.59,30.97 R6.1
N$52
  Top 0.254: D3.A 10.66,19.11 R14.1
N$54
  Top 0.254: R12.1 10.69,22.36 D1.A
RST
  Top 0.2: U$1.14 17.21,21.76 13.46,18.02
  Top 0.254: 13.46,18.02 13.46,14.46 11.43,12.43 SL2.4 11.99,10.35 R22.2
SCL
  Top 0.2: 13.46,20.87 13.46,21.51 15.32,23.36 U$1.10
  Top 0.203: 13.72,6.91 13.97,6.66 14.22,6.91
  Top 0.254: 13.46,20.87 12.41,19.82 12.41,14.87 11.6,14.06 11.53,14.06 11.43,13.95 7.87,13.95 6.86,12.94 6.86,8.87 8.38,7.35 SL2.2 10.34,6.91 13.72,6.91 13.97,6.91 | IC1.6 14.22,6.91 13.97,6.91 | 13.97,6.91 13.97,6.66 13.97,6.59 13.97,4.82 14.49,4.3 R24.2
SDA
  Top 0.2: 13.97,20.56 13.97,21.44 15.49,22.96 U$1.11
  Top 0.254: 13.97,20.56 12.82,19.41 12.82,14.7 11.67,13.55 8.04,13.55 7.37,12.87 7.37,10.4 7.87,9.89 SL2.3 10.92,8.87 R23.2 14.99,7.87 14.99,7.86 15.28,7.56 IC1.5
SW1
  Top 0.152: U$1.38 U$1.39 | U$1.39 U$1.40 U$1.41 | U$1.39 27.81,25.76 28.19,26.15
  pour Top (no thermals): 27.18,25.64 28.7,25.64 28.7,33.26 29.72,34.27 34.8,34.27 34.8,37.32 29.21,37.32 28.7,36.81 28.7,35.29 27.69,34.27 27.69,27.16 27.18,26.65
SW2
  Top 0.152: U$1.30 U$1.31 | U$1.31 U$1.32 U$1.33 | 28.19,22.59 28.17,22.56 28.15,22.54 U$1.31
  Top 0.254: C21.1 27.94,17.6 R26.1 30.22,16.23 C29.2 | C30.2 C29.2 | C29.2 C19.2
  pour Top (no thermals): 27.18,21.57 27.18,23.1 30.73,23.1 arc-90 31.24,22.59 31.24,12.94 29.21,12.94 arc-90 27.69,14.46 28.7,14.46 28.7,15.78 arc-90 28.73,15.81 27.58,15.81 27.58,18.53 27.69,18.53 28.19,19.03 28.37,21.04 27.86,21.55
VBUS  (via drill 0.35)
  Top 0.152: U$1.15 19.13,20 19.05,19.92
  Top 0.2: 13.97,17.95 15.94,19.92 19.05,19.92
  Top 0.254: v14.48,14.46 13.97,14.97 13.97,17.95
  Bottom 0.254: v13.97,35.8 14.33,36.46 16.27,36.46 16.66,36.07 16.66,35.53 16.51,35.38 16.51,20.56 14.48,18.53 v14.48,14.46
  pour Top (no thermals): 8.38,32.24 10.41,34.27 12.95,34.27 13.46,34.78 13.46,37.32 14,37.53 14.1,37.5 14.5,37.35 14.53,34.81 13.46,33.26 11.94,33.26 10.92,32.24
VDD  (via drill 0.35)
  Top 0.2: U$1.18 20.34,18.8 20.07,18.53
  Top 0.254: C22.2 C23.2 18.29,17.76 v19.05,18.53 20.07,18.53 | R3.2 22.85,40.38 R2.2 20.83,42.4 PAD3.1 | v17.02,36.81 16.3,36.81 Q2.6
  Bottom 0.254: v19.05,18.53 17.53,20.05 17.53,26.08 19.71,28.26 19.71,34.12 v17.02,36.81
  pour Top (no thermals): 15.04,36.99 16.03,36.99 16,39.35 14.99,39.35 14.99,38.85 11.43,38.85 11.43,38.34 11.4,38.31 14.66,38.29 14.94,38.24
  pour Top (no thermals): 11.43,38.34 11.43,42.91 11.94,43.42 15.49,43.42 15.49,41.39 14.48,41.39 13.46,40.37 13.46,38.85 13.46,38.34
  pour Top (no thermals): 15.49,43.42 22.1,43.42 23.11,42.4 23.11,40.37 21.59,40.37 21.08,40.37 20.57,40.88 20.07,41.39 15.49,41.39
WP  (via drill 0.35)
  Top 0.254: R25.2 16.65,4.93 15.88,4.93 v14.99,5.83 15.42,6.26 IC1.7 | SL2.1 12.45,4.81 14.48,2.78 v14.99,2.78
  Bottom 0.254: v14.99,5.83 v14.99,2.78